# EAGLE schematic Tyr (EAGLE 9.5.2)

## Sheet 1 of 3
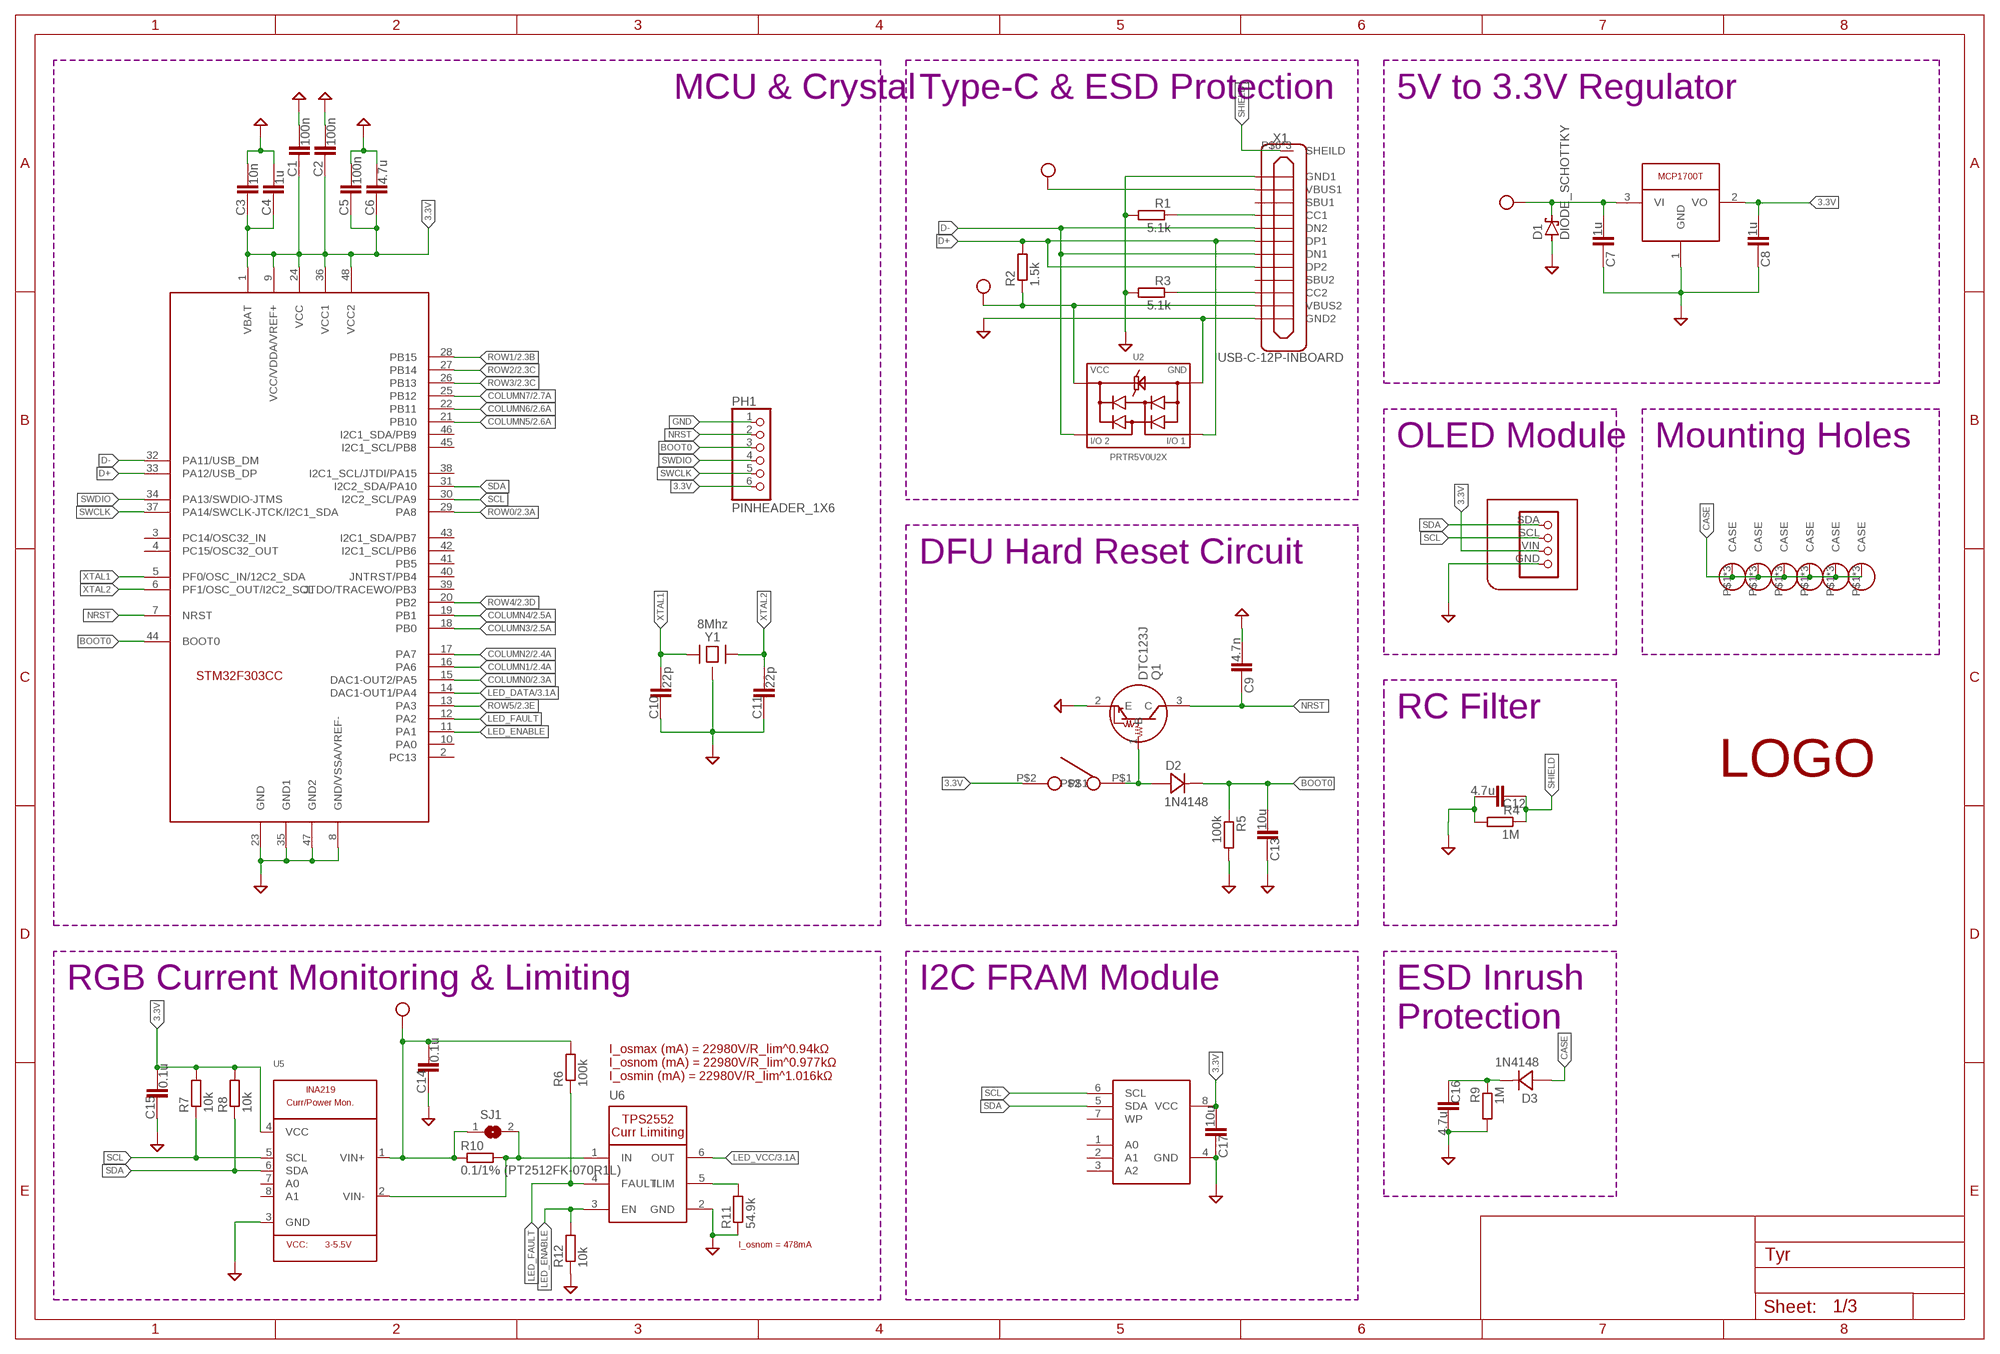
[diagram p0: schematic, sheet 1]

### Parts
C1  100n  CAPACITOR-0603  [C0603]
C2  100n  CAPACITOR-0603  [C0603]
C3  10n  CAPACITOR-0603  [C0603]
C4  1u  CAPACITOR-0603  [C0603]
C5  100n  CAPACITOR-0603  [C0603]
C6  4.7u  CAPACITOR-0603  [C0603]
C7  1u  CAPACITOR-0603  [C0603]
C8  1u  CAPACITOR-0603  [C0603]
C9  4.7n  CAPACITOR-0603  [C0603]
C10  22p  CAPACITOR-0603  [C0603]
C11  22p  CAPACITOR-0603  [C0603]
C12  4.7u  CAPACITOR-0603  [C0603]
C13  10u  CAPACITOR-0603  [C0603]
C14  0.1u  CAPACITOR-0603  [C0603]
C15  0.1u  CAPACITOR-0603  [C0603]
C16  4.7u  CAPACITOR-0603  [C0603]
C17  10u  CAPACITOR-0603  [C0603]
D1  DIODE_SCHOTTKY  [SOD-123]
D2  1N4148  DIODE-SOD-123  [SOD-123]
D3  1N4148  DIODE-SOD-123  [SOD-123]
HOLE1  MOUNT_HOLE-5MM_NOTCH  [HOLE_5MM_OVAL]
HOLE2  MOUNT_HOLE-5MM_NOTCH  [HOLE_5MM_OVAL]
HOLE3  MOUNT_HOLE  [HOLE_M3_OVAL]
HOLE4  MOUNT_HOLE  [HOLE_M3_OVAL]
HOLE5  MOUNT_HOLE  [HOLE_M3_OVAL]
HOLE6  MOUNT_HOLE  [HOLE_M3_OVAL]
J1  TYR_DISPLAY  [TYR_TYR_DISPLAY]
LOGO1  LOGO_TYR  [LOGO_TYR_COPPER]
PH1  PINHEADER_1X6  [1X06]
Q1  DTC123J  [SOT-323]
R1  5.1k  RESISTOR-0603  [R0603]
R2  1.5k  RESISTOR-0603  [R0603]
R3  5.1k  RESISTOR-0603  [R0603]
R4  1M  RESISTOR-0603  [R0603]
R5  100k  RESISTOR-0603  [R0603]
R6  100k  RESISTOR-0603  [R0603]
R7  10k  RESISTOR-0603  [R0603]
R8  10k  RESISTOR-0603  [R0603]
R9  1M  RESISTOR-0603  [R0603]
R10  0.1/1% (PT2512FK-070R1L)  RESISTOR-2512  [R2512]
R11  54.9k  RESISTOR-0603  [R0603]
R12  10k  RESISTOR-0603  [R0603]
SJ1  SOLDERJUMPER  [SOLDERJUMPER_ARROW_NOPASTE]
SW1  BUTTON  [BUTTON_3*6*2.5]
U1  MCP1700T  [SOT-23]
U2  PRTR5V0U2X  [PRTR5V0U2X]
U3  STM32F303CC  [LQFP48]
U4  MB85RC256V  [SOP-8]
U5  INA219  [SOT23-8]
U6  TPS2552  [SOT-23-6P]
X1  USB-C-12P-INBOARD  CONTROLLER_USB-C-12PUSB-C-12P-INBOARD  [USB-C-12P-INBOARD]
Y1  8Mhz  CRYSTAL-4PIN-3.2X2.5  [CRYSTAL-3.2X2.5]

### Nets
3.3V: C1.1 C2.1 C3.1 C4.1 C5.1 C6.1 C8.2 C15.2 C17.2 J1.VIN PH1.6 R7.2 R8.2 SW1.P$2 U1.2(VO) U3.1(VBAT) U3.9(VCC/VDDA/VREF+) U3.24(VCC) U3.36(VCC1) U3.48(VCC2) U4.8(VCC) U5.4(VCC)
BOOT0: C13.2 D2.C PH1.3 R5.1 U3.44(BOOT0)
CASE: D3.A HOLE1.P$1(CASE) HOLE1.P$2(CASE) HOLE1.P$3(CASE) HOLE2.P$1(CASE) HOLE2.P$2(CASE) HOLE2.P$3(CASE) HOLE3.P$1(CASE) HOLE3.P$2(CASE) HOLE3.P$3(CASE) HOLE4.P$1(CASE) HOLE4.P$2(CASE) HOLE4.P$3(CASE) HOLE5.P$1(CASE) HOLE5.P$2(CASE) HOLE5.P$3(CASE) HOLE6.P$1(CASE) HOLE6.P$2(CASE) HOLE6.P$3(CASE)
COLUMN0: U3.15(DAC1-OUT2/PA5) ; also sheet 2
COLUMN1: U3.16(PA6) ; also sheet 2
COLUMN2: U3.17(PA7) ; also sheet 2
COLUMN3: U3.18(PB0) ; also sheet 2
COLUMN4: U3.19(PB1) ; also sheet 2
COLUMN5: U3.21(PB10) ; also sheet 2
COLUMN6: U3.22(PB11) ; also sheet 2
COLUMN7: U3.25(PB12) ; also sheet 2
D+: R2.2 U2.2 U3.33(PA12/USB_DP) X1.DP1 X1.DP2
D-: U2.3 U3.32(PA11/USB_DM) X1.DN1 X1.DN2
GND: C1.2 C2.2 C3.2 C4.2 C5.2 C6.2 C7.1 C8.1 C9.2 C10.1 C11.1 C12.2 C13.1 C14.1 C15.1 C16.2 C17.1 D1.A J1.GND PH1.1 Q1.2(E) R1.2 R3.2 R4.2 R5.2 R9.2 R11.1 R12.1 U1.1(GND) U2.1 U3.8(GND/VSSA/VREF-) U3.23(GND) U3.35(GND1) U3.47(GND2) U4.4(GND) U5.3(GND) U6.2(GND) X1.GND1 X1.GND2 Y1.2(GND) Y1.4(GND) ; also sheet 2,3
LED_DATA: U3.14(DAC1-OUT1/PA4) ; also sheet 3
LED_ENABLE: R12.2 U3.11(PA1) U6.3(EN)
LED_FAULT: R6.1 U3.12(PA2) U6.4(FAULT)
LED_VCC: U6.6(OUT) ; also sheet 3
N$2: R10.2 SJ1.2 U5.2(VIN-) U6.1(IN)
N$3: R11.2 U6.5(ILIM)
N$4: R1.1 X1.CC1
N$5: D2.A Q1.1(B) SW1.P$1
N$6: C16.1 D3.C R9.1
N$89: R3.1 X1.CC2
NRST: C9.1 PH1.2 Q1.3(C) U3.7(NRST)
ROW0: U3.29(PA8) ; also sheet 2
ROW1: U3.28(PB15) ; also sheet 2
ROW2: U3.27(PB14) ; also sheet 2
ROW3: U3.26(PB13) ; also sheet 2
ROW4: U3.20(PB2) ; also sheet 2
ROW5: U3.13(PA3) ; also sheet 2
SCL: J1.SCL R7.1 U3.30(I2C2_SCL/PA9) U4.6(SCL) U5.5(SCL)
SDA: J1.SDA R8.1 U3.31(I2C2_SDA/PA10) U4.5(SDA) U5.6(SDA)
SHIELD: C12.1 R4.1 X1.P$6(SHEILD) X1.P$9(SHEILD) X1.P$12(SHEILD)
SWCLK: PH1.5 U3.37(PA14/SWCLK-JTCK/I2C1_SDA)
SWDIO: PH1.4 U3.34(PA13/SWDIO-JTMS)
VCC: C7.2 C14.2 D1.C R2.1 R6.2 R10.1 SJ1.1 U1.3(VI) U2.4 U5.1(VIN+) X1.VBUS1 X1.VBUS2
XTAL1: C10.2 U3.5(PF0/OSC_IN/12C2_SDA) Y1.1
XTAL2: C11.2 U3.6(PF1/OSC_OUT/I2C2_SCL) Y1.3
Unconnected: U3.2(PC13) U3.3(PC14/OSC32_IN) U3.4(PC15/OSC32_OUT) U3.10(PA0) U3.38(I2C1_SCL/JTDI/PA15) U3.39(JTDO/TRACEWO/PB3) U3.40(JNTRST/PB4) U3.41(PB5) U3.42(I2C1_SCL/PB6) U3.43(I2C1_SDA/PB7) U3.45(I2C1_SCL/PB8) U3.46(I2C1_SDA/PB9) U4.1(A0) U4.2(A1) U4.3(A2) U4.7(WP) U5.7(A0) U5.8(A1) X1.SBU1 X1.SBU2

### Notes on the sheet
- MCU & Crystal | Type-C & ESD Protection | 5V to 3.3V Regulator
- OLED Module | Mounting Holes
- DFU Hard Reset Circuit
- RC Filter
- RGB Current Monitoring & Limiting | I2C FRAM Module
- ESD Inrush
  Protection
- I_osmax (mA) = 22980V/R_lim^0.94kΩ
  I_osnom (mA) = 22980V/R_lim^0.977kΩ
  I_osmin (mA) = 22980V/R_lim^1.016kΩ
- I_osnom = 478mA

## Sheet 2 of 3: Keysiwtch Matrix
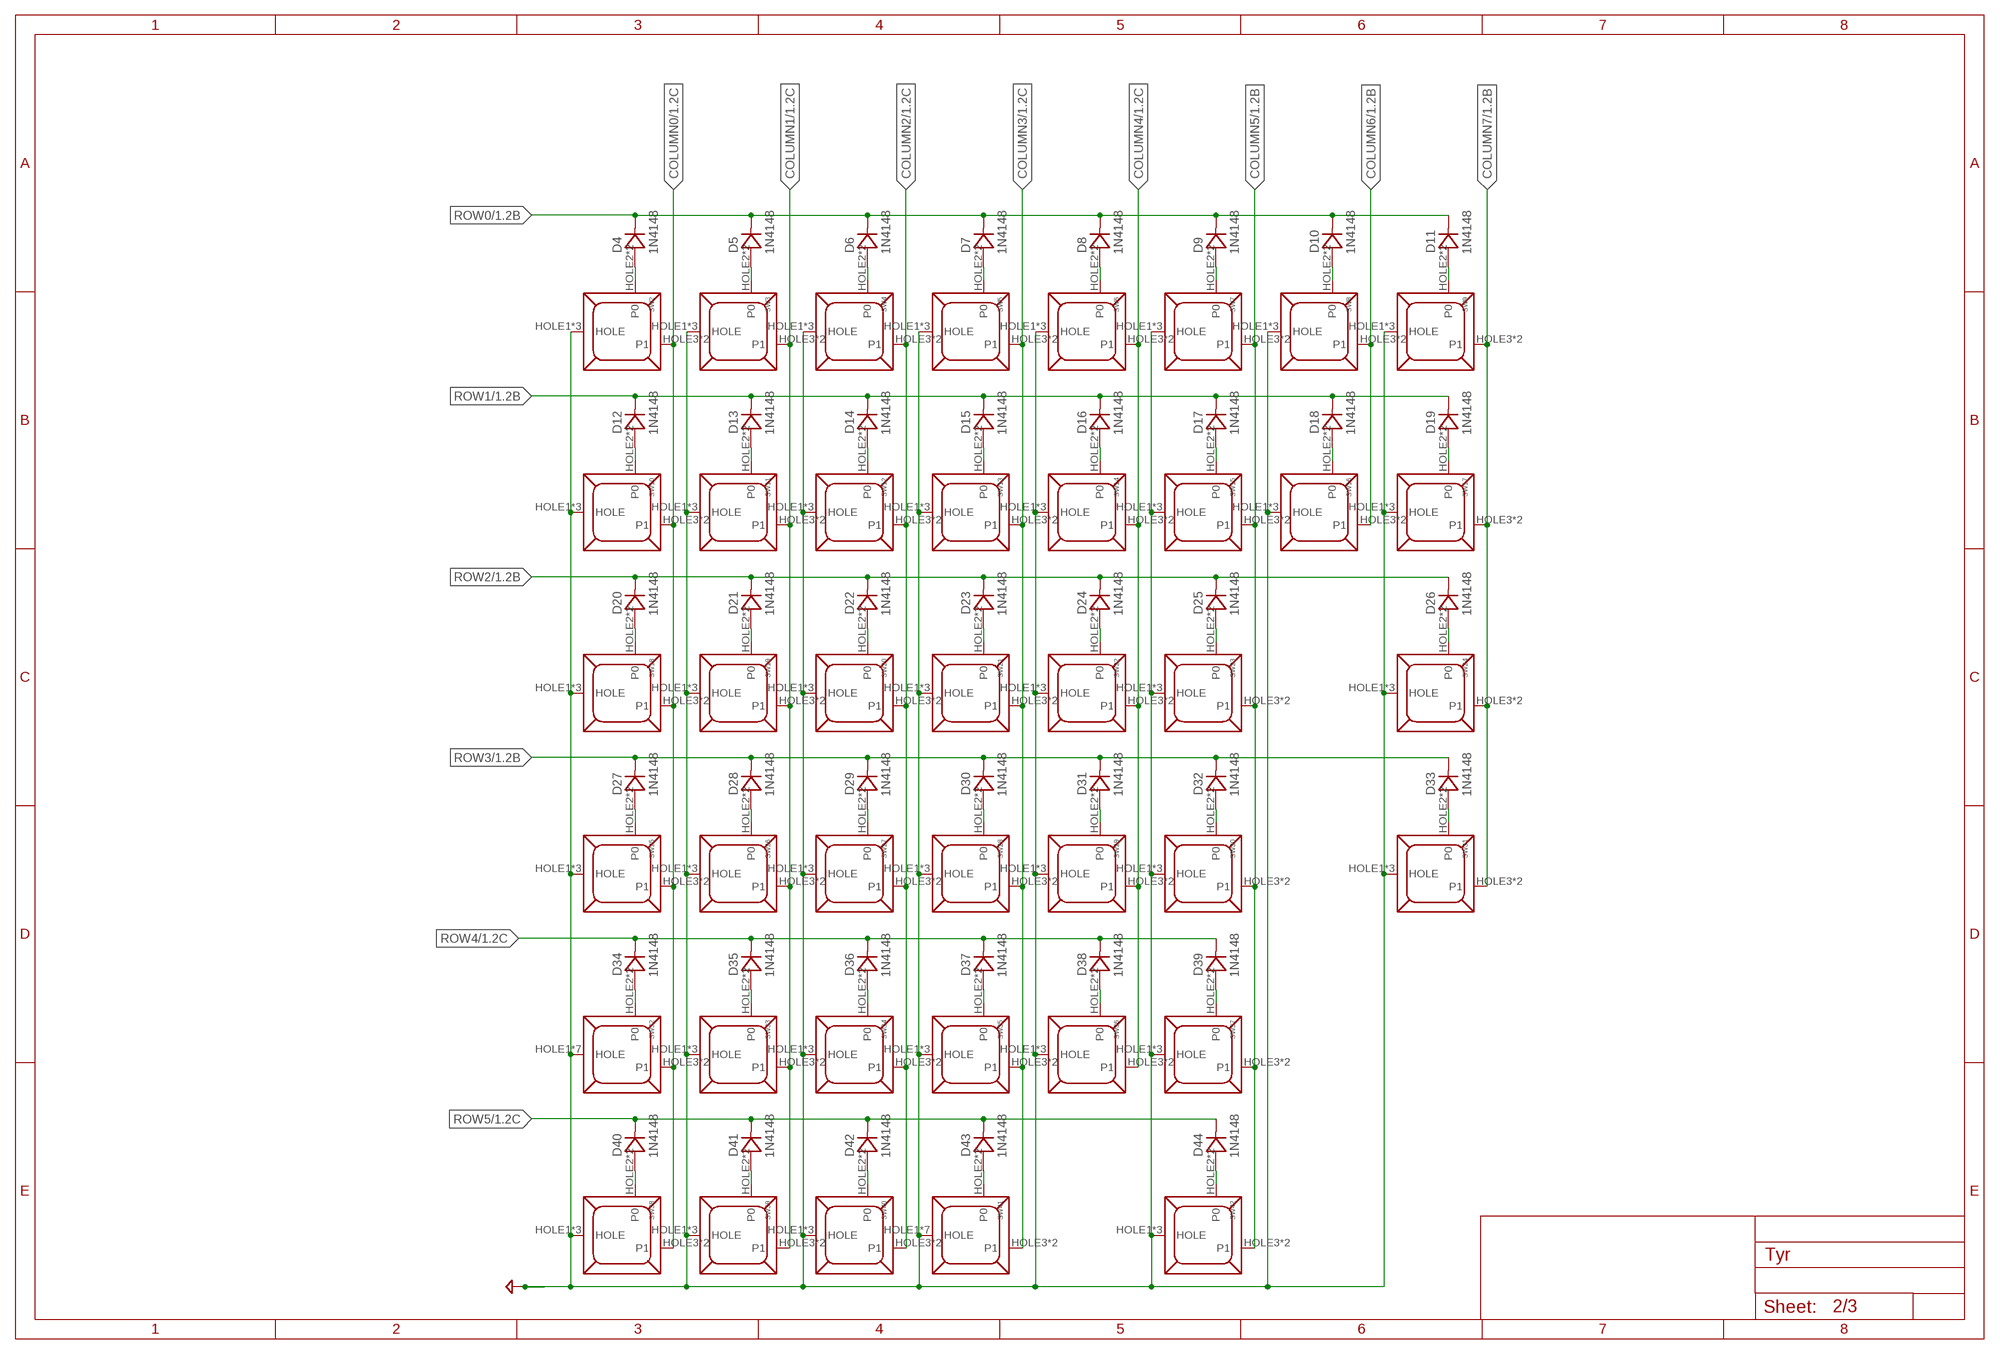
[diagram p1: schematic, sheet 2]

### Parts
D4  1N4148  DIODE-SOD-123  [SOD-123]
D5  1N4148  DIODE-SOD-123  [SOD-123]
D6  1N4148  DIODE-SOD-123  [SOD-123]
D7  1N4148  DIODE-SOD-123  [SOD-123]
D8  1N4148  DIODE-SOD-123  [SOD-123]
D9  1N4148  DIODE-SOD-123  [SOD-123]
D10  1N4148  DIODE-SOD-123  [SOD-123]
D11  1N4148  DIODE-SOD-123  [SOD-123]
D12  1N4148  DIODE-SOD-123  [SOD-123]
D13  1N4148  DIODE-SOD-123  [SOD-123]
D14  1N4148  DIODE-SOD-123  [SOD-123]
D15  1N4148  DIODE-SOD-123  [SOD-123]
D16  1N4148  DIODE-SOD-123  [SOD-123]
D17  1N4148  DIODE-SOD-123  [SOD-123]
D18  1N4148  DIODE-SOD-123  [SOD-123]
D19  1N4148  DIODE-SOD-123  [SOD-123]
D20  1N4148  DIODE-SOD-123  [SOD-123]
D21  1N4148  DIODE-SOD-123  [SOD-123]
D22  1N4148  DIODE-SOD-123  [SOD-123]
D23  1N4148  DIODE-SOD-123  [SOD-123]
D24  1N4148  DIODE-SOD-123  [SOD-123]
D25  1N4148  DIODE-SOD-123  [SOD-123]
D26  1N4148  DIODE-SOD-123  [SOD-123]
D27  1N4148  DIODE-SOD-123  [SOD-123]
D28  1N4148  DIODE-SOD-123  [SOD-123]
D29  1N4148  DIODE-SOD-123  [SOD-123]
D30  1N4148  DIODE-SOD-123  [SOD-123]
D31  1N4148  DIODE-SOD-123  [SOD-123]
D32  1N4148  DIODE-SOD-123  [SOD-123]
D33  1N4148  DIODE-SOD-123  [SOD-123]
D34  1N4148  DIODE-SOD-123  [SOD-123]
D35  1N4148  DIODE-SOD-123  [SOD-123]
D36  1N4148  DIODE-SOD-123  [SOD-123]
D37  1N4148  DIODE-SOD-123  [SOD-123]
D38  1N4148  DIODE-SOD-123  [SOD-123]
D39  1N4148  DIODE-SOD-123  [SOD-123]
D40  1N4148  DIODE-SOD-123  [SOD-123]
D41  1N4148  DIODE-SOD-123  [SOD-123]
D42  1N4148  DIODE-SOD-123  [SOD-123]
D43  1N4148  DIODE-SOD-123  [SOD-123]
D44  1N4148  DIODE-SOD-123  [SOD-123]
SW2  MX  KEYSWITCH-MX_PLATED-1U-HOTSWAP  [MX-1U-HOTSWAP]
SW3  MX  KEYSWITCH-MX_PLATED-1U-HOTSWAP  [MX-1U-HOTSWAP]
SW4  MX  KEYSWITCH-MX_PLATED-1U-HOTSWAP  [MX-1U-HOTSWAP]
SW5  MX  KEYSWITCH-MX_PLATED-1U-HOTSWAP  [MX-1U-HOTSWAP]
SW6  MX  KEYSWITCH-MX_PLATED-1U-HOTSWAP  [MX-1U-HOTSWAP]
SW7  MX  KEYSWITCH-MX_PLATED-1U-HOTSWAP  [MX-1U-HOTSWAP]
SW8  MX  KEYSWITCH-MX_PLATED-1U-HOTSWAP  [MX-1U-HOTSWAP]
SW9  MX  KEYSWITCH-MX_PLATED-1U-HOTSWAP  [MX-1U-HOTSWAP]
SW10  MX  KEYSWITCH-MX_PLATED-1U-HOTSWAP  [MX-1U-HOTSWAP]
SW11  MX  KEYSWITCH-MX_PLATED-1U-HOTSWAP  [MX-1U-HOTSWAP]
SW12  MX  KEYSWITCH-MX_PLATED-1U-HOTSWAP  [MX-1U-HOTSWAP]
SW13  MX  KEYSWITCH-MX_PLATED-1U-HOTSWAP  [MX-1U-HOTSWAP]
SW14  MX  KEYSWITCH-MX_PLATED-1U-HOTSWAP  [MX-1U-HOTSWAP]
SW15  MX  KEYSWITCH-MX_PLATED-1U-HOTSWAP  [MX-1U-HOTSWAP]
SW16  MX  KEYSWITCH-MX_PLATED-1U-HOTSWAP  [MX-1U-HOTSWAP]
SW17  MX  KEYSWITCH-MX_PLATED-1U-HOTSWAP  [MX-1U-HOTSWAP]
SW18  MX  KEYSWITCH-MX_PLATED-1U-HOTSWAP  [MX-1U-HOTSWAP]
SW19  MX  KEYSWITCH-MX_PLATED-1U-HOTSWAP  [MX-1U-HOTSWAP]
SW20  MX  KEYSWITCH-MX_PLATED-1U-HOTSWAP  [MX-1U-HOTSWAP]
SW21  MX  KEYSWITCH-MX_PLATED-1U-HOTSWAP  [MX-1U-HOTSWAP]
SW22  MX  KEYSWITCH-MX_PLATED-1U-HOTSWAP  [MX-1U-HOTSWAP]
SW23  MX  KEYSWITCH-MX_PLATED-1U-HOTSWAP  [MX-1U-HOTSWAP]
SW24  MX  KEYSWITCH-MX_PLATED-1U-HOTSWAP  [MX-1U-HOTSWAP]
SW25  MX  KEYSWITCH-MX_PLATED-1U-HOTSWAP_CAPSLOCK  [MX-1U-HOTSWAP-CAPSLOCK]
SW26  MX  KEYSWITCH-MX_PLATED-1U-HOTSWAP  [MX-1U-HOTSWAP]
SW27  MX  KEYSWITCH-MX_PLATED-1U-HOTSWAP  [MX-1U-HOTSWAP]
SW28  MX  KEYSWITCH-MX_PLATED-1U-HOTSWAP  [MX-1U-HOTSWAP]
SW29  MX  KEYSWITCH-MX_PLATED-1U-HOTSWAP  [MX-1U-HOTSWAP]
SW30  MX  KEYSWITCH-MX_PLATED-1U-HOTSWAP  [MX-1U-HOTSWAP]
SW31  MX  KEYSWITCH-MX_PLATED-1U-HOTSWAP  [MX-1U-HOTSWAP]
SW32  MX  KEYSWITCH-MX_PLATED-2U-HOTSWAP  [MX-2U-HOTSWAP]
SW33  MX  KEYSWITCH-MX_PLATED-1U-HOTSWAP  [MX-1U-HOTSWAP]
SW34  MX  KEYSWITCH-MX_PLATED-1U-HOTSWAP  [MX-1U-HOTSWAP]
SW35  MX  KEYSWITCH-MX_PLATED-1U-HOTSWAP  [MX-1U-HOTSWAP]
SW36  MX  KEYSWITCH-MX_PLATED-1U-HOTSWAP  [MX-1U-HOTSWAP]
SW37  MX  KEYSWITCH-MX_PLATED-1U-HOTSWAP  [MX-1U-HOTSWAP]
SW38  MX  KEYSWITCH-MX_PLATED-1U-HOTSWAP  [MX-1U-HOTSWAP]
SW39  MX  KEYSWITCH-MX_PLATED-1U-HOTSWAP  [MX-1U-HOTSWAP]
SW40  MX  KEYSWITCH-MX_PLATED-1U-HOTSWAP  [MX-1U-HOTSWAP]
SW41  MX  KEYSWITCH-MX_PLATED-2U-HOTSWAP  [MX-2U-HOTSWAP]
SW42  MX  KEYSWITCH-MX_PLATED-1U-HOTSWAP  [MX-1U-HOTSWAP]

### Nets
COLUMN0: SW2.HOLE3(P1) SW2.P$1(P1) SW10.HOLE3(P1) SW10.P$1(P1) SW18.HOLE3(P1) SW18.P$1(P1) SW25.HOLE3(P1) SW25.P$1(P1) SW32.HOLE3(P1) SW32.P$1(P1) SW38.HOLE3(P1) SW38.P$1(P1) ; also sheet 1
COLUMN1: SW3.HOLE3(P1) SW3.P$1(P1) SW11.HOLE3(P1) SW11.P$1(P1) SW19.HOLE3(P1) SW19.P$1(P1) SW26.HOLE3(P1) SW26.P$1(P1) SW33.HOLE3(P1) SW33.P$1(P1) SW39.HOLE3(P1) SW39.P$1(P1) ; also sheet 1
COLUMN2: SW4.HOLE3(P1) SW4.P$1(P1) SW12.HOLE3(P1) SW12.P$1(P1) SW20.HOLE3(P1) SW20.P$1(P1) SW27.HOLE3(P1) SW27.P$1(P1) SW34.HOLE3(P1) SW34.P$1(P1) SW40.HOLE3(P1) SW40.P$1(P1) ; also sheet 1
COLUMN3: SW5.HOLE3(P1) SW5.P$1(P1) SW13.HOLE3(P1) SW13.P$1(P1) SW21.HOLE3(P1) SW21.P$1(P1) SW28.HOLE3(P1) SW28.P$1(P1) SW35.HOLE3(P1) SW35.P$1(P1) SW41.HOLE3(P1) SW41.P$1(P1) ; also sheet 1
COLUMN4: SW6.HOLE3(P1) SW6.P$1(P1) SW14.HOLE3(P1) SW14.P$1(P1) SW22.HOLE3(P1) SW22.P$1(P1) SW29.HOLE3(P1) SW29.P$1(P1) SW36.HOLE3(P1) SW36.P$1(P1) ; also sheet 1
COLUMN5: SW7.HOLE3(P1) SW7.P$1(P1) SW15.HOLE3(P1) SW15.P$1(P1) SW23.HOLE3(P1) SW23.P$1(P1) SW30.HOLE3(P1) SW30.P$1(P1) SW37.HOLE3(P1) SW37.P$1(P1) SW42.HOLE3(P1) SW42.P$1(P1) ; also sheet 1
COLUMN6: SW8.HOLE3(P1) SW8.P$1(P1) SW16.HOLE3(P1) SW16.P$1(P1) ; also sheet 1
COLUMN7: SW9.HOLE3(P1) SW9.P$1(P1) SW17.HOLE3(P1) SW17.P$1(P1) SW24.HOLE3(P1) SW24.P$1(P1) SW31.HOLE3(P1) SW31.P$1(P1) ; also sheet 1
GND: SW2.HOLE1(HOLE) SW2.HOLE4(HOLE) SW2.HOLE5(HOLE) SW3.HOLE1(HOLE) SW3.HOLE4(HOLE) SW3.HOLE5(HOLE) SW4.HOLE1(HOLE) SW4.HOLE4(HOLE) SW4.HOLE5(HOLE) SW5.HOLE1(HOLE) SW5.HOLE4(HOLE) SW5.HOLE5(HOLE) SW6.HOLE1(HOLE) SW6.HOLE4(HOLE) SW6.HOLE5(HOLE) SW7.HOLE1(HOLE) SW7.HOLE4(HOLE) SW7.HOLE5(HOLE) SW8.HOLE1(HOLE) SW8.HOLE4(HOLE) SW8.HOLE5(HOLE) SW9.HOLE1(HOLE) SW9.HOLE4(HOLE) SW9.HOLE5(HOLE) SW10.HOLE1(HOLE) SW10.HOLE4(HOLE) SW10.HOLE5(HOLE) SW11.HOLE1(HOLE) SW11.HOLE4(HOLE) SW11.HOLE5(HOLE) SW12.HOLE1(HOLE) SW12.HOLE4(HOLE) SW12.HOLE5(HOLE) SW13.HOLE1(HOLE) SW13.HOLE4(HOLE) SW13.HOLE5(HOLE) SW14.HOLE1(HOLE) SW14.HOLE4(HOLE) SW14.HOLE5(HOLE) SW15.HOLE1(HOLE) SW15.HOLE4(HOLE) SW15.HOLE5(HOLE) SW16.HOLE1(HOLE) SW16.HOLE4(HOLE) SW16.HOLE5(HOLE) SW17.HOLE1(HOLE) SW17.HOLE4(HOLE) SW17.HOLE5(HOLE) SW18.HOLE1(HOLE) SW18.HOLE4(HOLE) SW18.HOLE5(HOLE) SW19.HOLE1(HOLE) SW19.HOLE4(HOLE) SW19.HOLE5(HOLE) SW20.HOLE1(HOLE) SW20.HOLE4(HOLE) SW20.HOLE5(HOLE) SW21.HOLE1(HOLE) SW21.HOLE4(HOLE) SW21.HOLE5(HOLE) SW22.HOLE1(HOLE) SW22.HOLE4(HOLE) SW22.HOLE5(HOLE) SW23.HOLE1(HOLE) SW23.HOLE4(HOLE) SW23.HOLE5(HOLE) SW24.HOLE1(HOLE) SW24.HOLE4(HOLE) SW24.HOLE5(HOLE) SW25.HOLE1(HOLE) SW25.HOLE4(HOLE) SW25.HOLE5(HOLE) SW26.HOLE1(HOLE) SW26.HOLE4(HOLE) SW26.HOLE5(HOLE) SW27.HOLE1(HOLE) SW27.HOLE4(HOLE) SW27.HOLE5(HOLE) SW28.HOLE1(HOLE) SW28.HOLE4(HOLE) SW28.HOLE5(HOLE) SW29.HOLE1(HOLE) SW29.HOLE4(HOLE) SW29.HOLE5(HOLE) SW30.HOLE1(HOLE) SW30.HOLE4(HOLE) SW30.HOLE5(HOLE) SW31.HOLE1(HOLE) SW31.HOLE4(HOLE) SW31.HOLE5(HOLE) SW32.HOLE1(HOLE) SW32.HOLE4(HOLE) SW32.HOLE5(HOLE) SW32.HOLE6(HOLE) SW32.HOLE7(HOLE) SW32.HOLE8(HOLE) SW32.HOLE9(HOLE) SW33.HOLE1(HOLE) SW33.HOLE4(HOLE) SW33.HOLE5(HOLE) SW34.HOLE1(HOLE) SW34.HOLE4(HOLE) SW34.HOLE5(HOLE) SW35.HOLE1(HOLE) SW35.HOLE4(HOLE) SW35.HOLE5(HOLE) SW36.HOLE1(HOLE) SW36.HOLE4(HOLE) SW36.HOLE5(HOLE) SW37.HOLE1(HOLE) SW37.HOLE4(HOLE) SW37.HOLE5(HOLE) SW38.HOLE1(HOLE) SW38.HOLE4(HOLE) SW38.HOLE5(HOLE) SW39.HOLE1(HOLE) SW39.HOLE4(HOLE) SW39.HOLE5(HOLE) SW40.HOLE1(HOLE) SW40.HOLE4(HOLE) SW40.HOLE5(HOLE) SW41.HOLE1(HOLE) SW41.HOLE4(HOLE) SW41.HOLE5(HOLE) SW41.HOLE6(HOLE) SW41.HOLE7(HOLE) SW41.HOLE8(HOLE) SW41.HOLE9(HOLE) SW42.HOLE1(HOLE) SW42.HOLE4(HOLE) SW42.HOLE5(HOLE) ; also sheet 1,3
N$1: D13.A SW11.HOLE2(P0) SW11.P$2(P0)
N$10: D4.A SW2.HOLE2(P0) SW2.P$2(P0)
N$11: D5.A SW3.HOLE2(P0) SW3.P$2(P0)
N$12: D6.A SW4.HOLE2(P0) SW4.P$2(P0)
N$13: D7.A SW5.HOLE2(P0) SW5.P$2(P0)
N$14: D8.A SW6.HOLE2(P0) SW6.P$2(P0)
N$15: D9.A SW7.HOLE2(P0) SW7.P$2(P0)
N$16: D10.A SW8.HOLE2(P0) SW8.P$2(P0)
N$17: D11.A SW9.HOLE2(P0) SW9.P$2(P0)
N$18: D19.A SW17.HOLE2(P0) SW17.P$2(P0)
N$19: D18.A SW16.HOLE2(P0) SW16.P$2(P0)
N$20: D17.A SW15.HOLE2(P0) SW15.P$2(P0)
N$21: D16.A SW14.HOLE2(P0) SW14.P$2(P0)
N$22: D15.A SW13.HOLE2(P0) SW13.P$2(P0)
N$23: D14.A SW12.HOLE2(P0) SW12.P$2(P0)
N$24: D12.A SW10.HOLE2(P0) SW10.P$2(P0)
N$25: D26.A SW24.HOLE2(P0) SW24.P$2(P0)
N$26: D25.A SW23.HOLE2(P0) SW23.P$2(P0)
N$27: D24.A SW22.HOLE2(P0) SW22.P$2(P0)
N$28: D23.A SW21.HOLE2(P0) SW21.P$2(P0)
N$29: D22.A SW20.HOLE2(P0) SW20.P$2(P0)
N$31: D20.A SW18.HOLE2(P0) SW18.P$2(P0)
N$32: D27.A SW25.HOLE2(P0) SW25.P$2(P0)
N$33: D28.A SW26.HOLE2(P0) SW26.P$2(P0)
N$34: D29.A SW27.HOLE2(P0) SW27.P$2(P0)
N$35: D30.A SW28.HOLE2(P0) SW28.P$2(P0)
N$36: D31.A SW29.HOLE2(P0) SW29.P$2(P0)
N$37: D32.A SW30.HOLE2(P0) SW30.P$2(P0)
N$38: D33.A SW31.HOLE2(P0) SW31.P$2(P0)
N$39: D39.A SW37.HOLE2(P0) SW37.P$2(P0)
N$40: D37.A SW35.HOLE2(P0) SW35.P$2(P0)
N$41: D36.A SW34.HOLE2(P0) SW34.P$2(P0)
N$42: D35.A SW33.HOLE2(P0) SW33.P$2(P0)
N$43: D34.A SW32.HOLE2(P0) SW32.P$2(P0)
N$44: D40.A SW38.HOLE2(P0) SW38.P$2(P0)
N$45: D41.A SW39.HOLE2(P0) SW39.P$2(P0)
N$46: D42.A SW40.HOLE2(P0) SW40.P$2(P0)
N$47: D43.A SW41.HOLE2(P0) SW41.P$2(P0)
N$48: D44.A SW42.HOLE2(P0) SW42.P$2(P0)
N$49: D38.A SW36.HOLE2(P0) SW36.P$2(P0)
N$50: D21.A SW19.HOLE2(P0) SW19.P$2(P0)
ROW0: D4.C D5.C D6.C D7.C D8.C D9.C D10.C D11.C ; also sheet 1
ROW1: D12.C D13.C D14.C D15.C D16.C D17.C D18.C D19.C ; also sheet 1
ROW2: D20.C D21.C D22.C D23.C D24.C D25.C D26.C ; also sheet 1
ROW3: D27.C D28.C D29.C D30.C D31.C D32.C D33.C ; also sheet 1
ROW4: D34.C D35.C D36.C D37.C D38.C D39.C ; also sheet 1
ROW5: D40.C D41.C D42.C D43.C D44.C ; also sheet 1

## Sheet 3 of 3: RGB Matrix
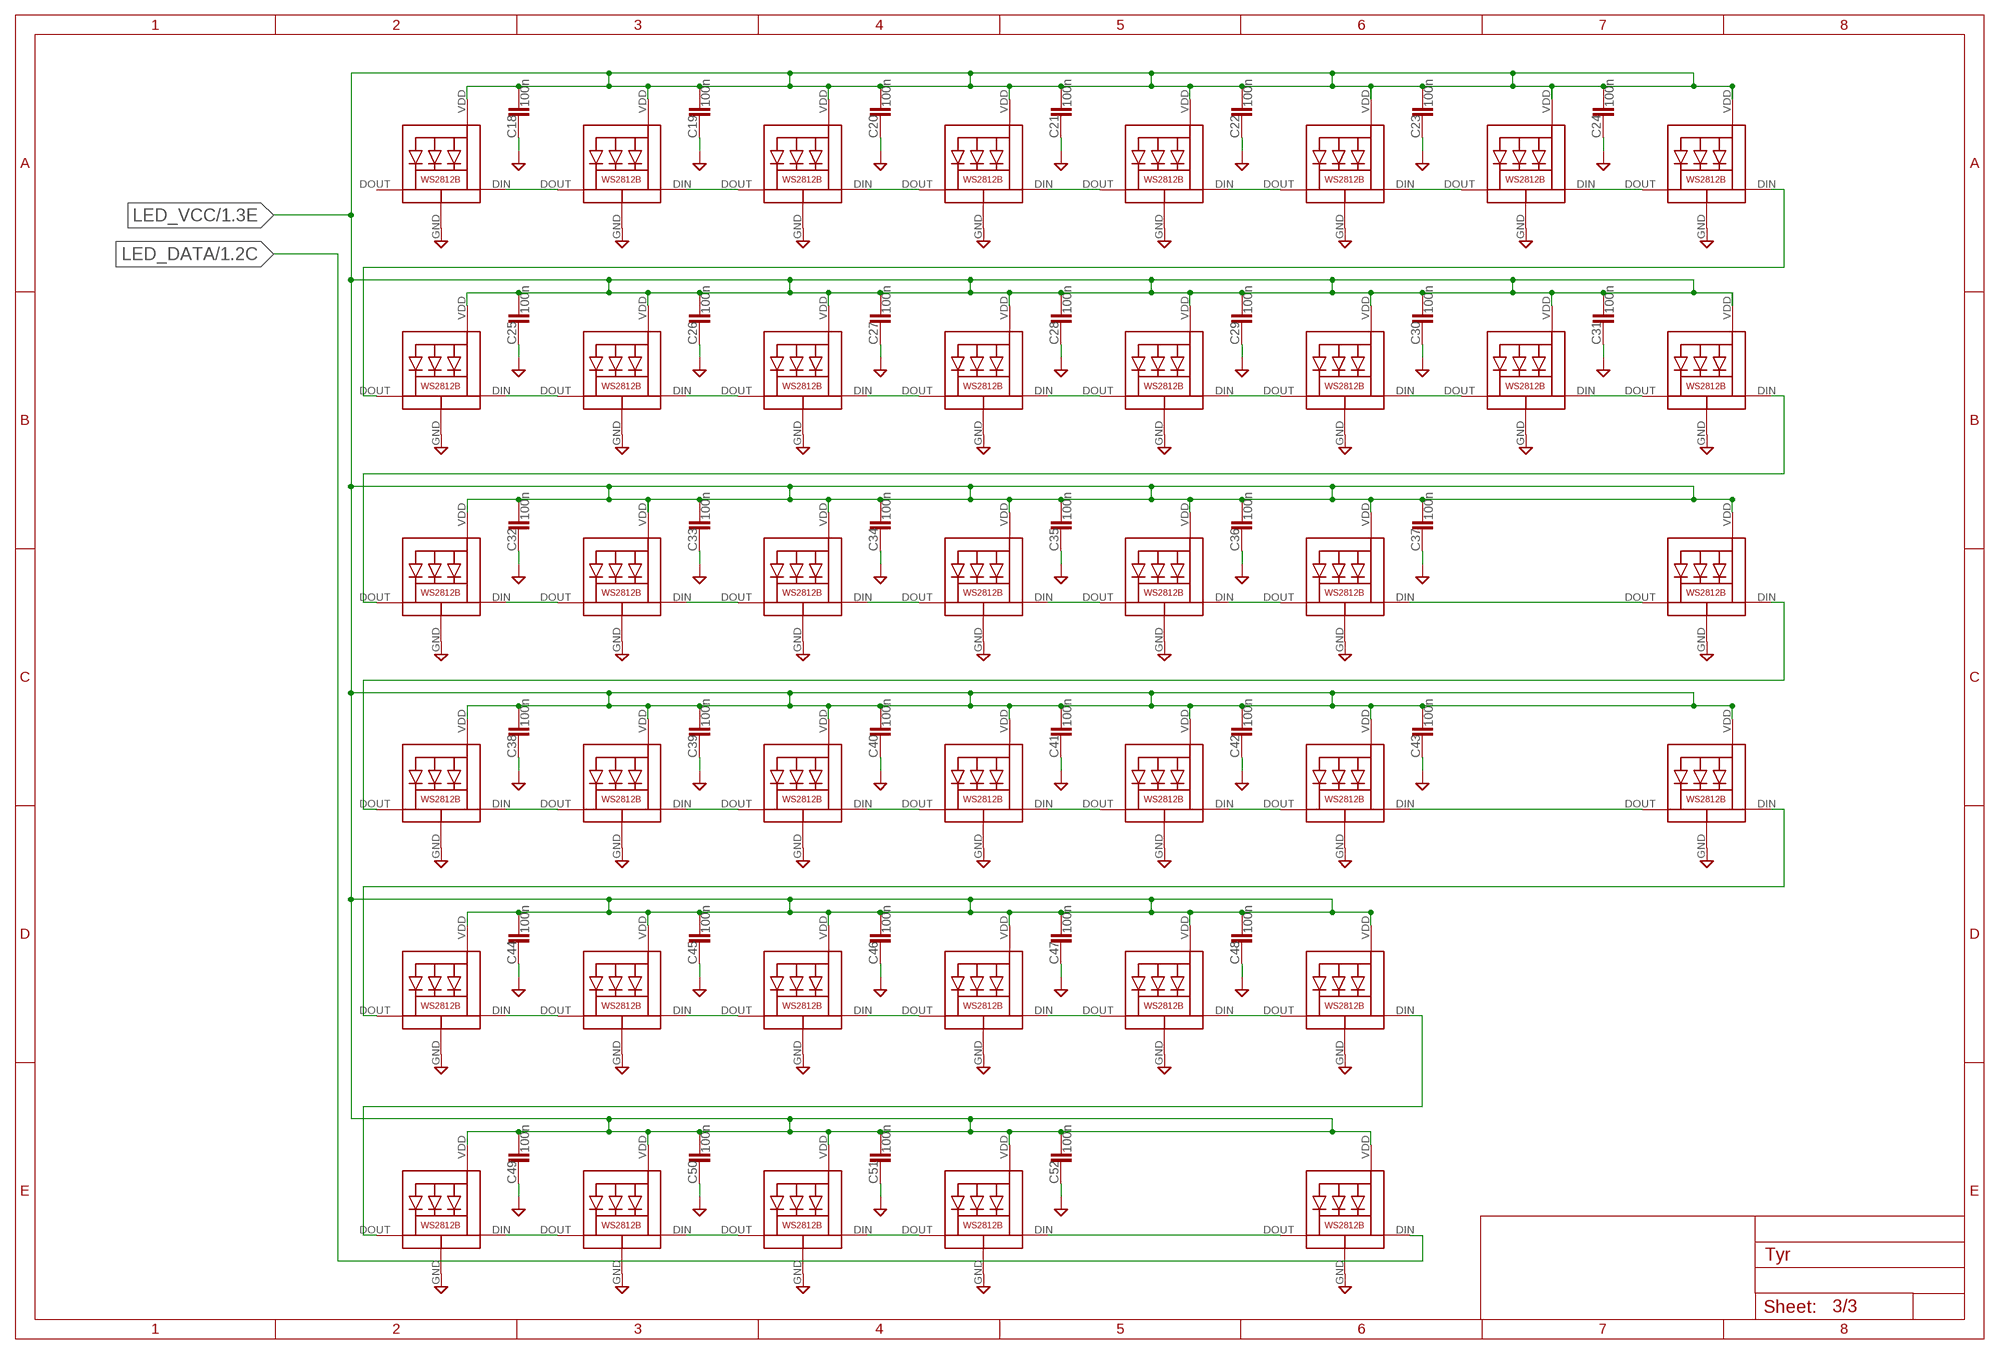
[diagram p2: schematic, sheet 3]

### Parts
C18  100n  CAPACITOR-0603  [C0603]
C19  100n  CAPACITOR-0603  [C0603]
C20  100n  CAPACITOR-0603  [C0603]
C21  100n  CAPACITOR-0603  [C0603]
C22  100n  CAPACITOR-0603  [C0603]
C23  100n  CAPACITOR-0603  [C0603]
C24  100n  CAPACITOR-0603  [C0603]
C25  100n  CAPACITOR-0603  [C0603]
C26  100n  CAPACITOR-0603  [C0603]
C27  100n  CAPACITOR-0603  [C0603]
C28  100n  CAPACITOR-0603  [C0603]
C29  100n  CAPACITOR-0603  [C0603]
C30  100n  CAPACITOR-0603  [C0603]
C31  100n  CAPACITOR-0603  [C0603]
C32  100n  CAPACITOR-0603  [C0603]
C33  100n  CAPACITOR-0603  [C0603]
C34  100n  CAPACITOR-0603  [C0603]
C35  100n  CAPACITOR-0603  [C0603]
C36  100n  CAPACITOR-0603  [C0603]
C37  100n  CAPACITOR-0603  [C0603]
C38  100n  CAPACITOR-0603  [C0603]
C39  100n  CAPACITOR-0603  [C0603]
C40  100n  CAPACITOR-0603  [C0603]
C41  100n  CAPACITOR-0603  [C0603]
C42  100n  CAPACITOR-0603  [C0603]
C43  100n  CAPACITOR-0603  [C0603]
C44  100n  CAPACITOR-0603  [C0603]
C45  100n  CAPACITOR-0603  [C0603]
C46  100n  CAPACITOR-0603  [C0603]
C47  100n  CAPACITOR-0603  [C0603]
C48  100n  CAPACITOR-0603  [C0603]
C49  100n  CAPACITOR-0603  [C0603]
C50  100n  CAPACITOR-0603  [C0603]
C51  100n  CAPACITOR-0603  [C0603]
C52  100n  CAPACITOR-0603  [C0603]
LED1  WS2812B_3528_REVERS-MOUNT  [WS2812B_3528_REVERS-MOUNT]
LED2  WS2812B_3528_REVERS-MOUNT  [WS2812B_3528_REVERS-MOUNT]
LED3  WS2812B_3528_REVERS-MOUNT  [WS2812B_3528_REVERS-MOUNT]
LED4  WS2812B_3528_REVERS-MOUNT  [WS2812B_3528_REVERS-MOUNT]
LED5  WS2812B_3528_REVERS-MOUNT  [WS2812B_3528_REVERS-MOUNT]
LED6  WS2812B_3528_REVERS-MOUNT  [WS2812B_3528_REVERS-MOUNT]
LED7  WS2812B_3528_REVERS-MOUNT  [WS2812B_3528_REVERS-MOUNT]
LED8  WS2812B_3528_REVERS-MOUNT  [WS2812B_3528_REVERS-MOUNT]
LED9  WS2812B_3528_REVERS-MOUNT  [WS2812B_3528_REVERS-MOUNT]
LED10  WS2812B_3528_REVERS-MOUNT  [WS2812B_3528_REVERS-MOUNT]
LED11  WS2812B_3528_REVERS-MOUNT  [WS2812B_3528_REVERS-MOUNT]
LED12  WS2812B_3528_REVERS-MOUNT  [WS2812B_3528_REVERS-MOUNT]
LED13  WS2812B_3528_REVERS-MOUNT  [WS2812B_3528_REVERS-MOUNT]
LED14  WS2812B_3528_REVERS-MOUNT  [WS2812B_3528_REVERS-MOUNT]
LED15  WS2812B_3528_REVERS-MOUNT  [WS2812B_3528_REVERS-MOUNT]
LED16  WS2812B_3528_REVERS-MOUNT  [WS2812B_3528_REVERS-MOUNT]
LED17  WS2812B_3528_REVERS-MOUNT  [WS2812B_3528_REVERS-MOUNT]
LED18  WS2812B_3528_REVERS-MOUNT  [WS2812B_3528_REVERS-MOUNT]
LED19  WS2812B_3528_REVERS-MOUNT  [WS2812B_3528_REVERS-MOUNT]
LED20  WS2812B_3528_REVERS-MOUNT  [WS2812B_3528_REVERS-MOUNT]
LED21  WS2812B_3528_REVERS-MOUNT  [WS2812B_3528_REVERS-MOUNT]
LED22  WS2812B_3528_REVERS-MOUNT  [WS2812B_3528_REVERS-MOUNT]
LED23  WS2812B_3528_REVERS-MOUNT  [WS2812B_3528_REVERS-MOUNT]
LED24  WS2812B_3528_REVERS-MOUNT  [WS2812B_3528_REVERS-MOUNT]
LED25  WS2812B_3528_REVERS-MOUNT  [WS2812B_3528_REVERS-MOUNT]
LED26  WS2812B_3528_REVERS-MOUNT  [WS2812B_3528_REVERS-MOUNT]
LED27  WS2812B_3528_REVERS-MOUNT  [WS2812B_3528_REVERS-MOUNT]
LED28  WS2812B_3528_REVERS-MOUNT  [WS2812B_3528_REVERS-MOUNT]
LED29  WS2812B_3528_REVERS-MOUNT  [WS2812B_3528_REVERS-MOUNT]
LED30  WS2812B_3528_REVERS-MOUNT  [WS2812B_3528_REVERS-MOUNT]
LED31  WS2812B_3528_REVERS-MOUNT  [WS2812B_3528_REVERS-MOUNT]
LED32  WS2812B_3528_REVERS-MOUNT  [WS2812B_3528_REVERS-MOUNT]
LED33  WS2812B_3528_REVERS-MOUNT  [WS2812B_3528_REVERS-MOUNT]
LED34  WS2812B_3528_REVERS-MOUNT  [WS2812B_3528_REVERS-MOUNT]
LED35  WS2812B_3528_REVERS-MOUNT  [WS2812B_3528_REVERS-MOUNT]
LED36  WS2812B_3528_REVERS-MOUNT  [WS2812B_3528_REVERS-MOUNT]
LED37  WS2812B_3528_REVERS-MOUNT  [WS2812B_3528_REVERS-MOUNT]
LED38  WS2812B_3528_REVERS-MOUNT  [WS2812B_3528_REVERS-MOUNT]
LED39  WS2812B_3528_REVERS-MOUNT  [WS2812B_3528_REVERS-MOUNT]
LED40  WS2812B_3528_REVERS-MOUNT  [WS2812B_3528_REVERS-MOUNT]
LED41  WS2812B_3528_REVERS-MOUNT  [WS2812B_3528_REVERS-MOUNT]

### Nets
GND: C18.1 C19.1 C20.1 C21.1 C22.1 C23.1 C24.1 C25.1 C26.1 C27.1 C28.1 C29.1 C30.1 C31.1 C32.1 C33.1 C34.1 C35.1 C36.1 C37.1 C38.1 C39.1 C40.1 C41.1 C42.1 C43.1 C44.1 C45.1 C46.1 C47.1 C48.1 C49.1 C50.1 C51.1 C52.1 LED1.GND LED2.GND LED3.GND LED4.GND LED5.GND LED6.GND LED7.GND LED8.GND LED9.GND LED10.GND LED11.GND LED12.GND LED13.GND LED14.GND LED15.GND LED16.GND LED17.GND LED18.GND LED19.GND LED20.GND LED21.GND LED22.GND LED23.GND LED24.GND LED25.GND LED26.GND LED27.GND LED28.GND LED29.GND LED30.GND LED31.GND LED32.GND LED33.GND LED34.GND LED35.GND LED36.GND LED37.GND LED38.GND LED39.GND LED40.GND LED41.GND ; also sheet 1,2
LED_DATA: LED41.DIN(DI) ; also sheet 1
LED_VCC: C18.2 C19.2 C20.2 C21.2 C22.2 C23.2 C24.2 C25.2 C26.2 C27.2 C28.2 C29.2 C30.2 C31.2 C32.2 C33.2 C34.2 C35.2 C36.2 C37.2 C38.2 C39.2 C40.2 C41.2 C42.2 C43.2 C44.2 C45.2 C46.2 C47.2 C48.2 C49.2 C50.2 C51.2 C52.2 LED1.VDD LED2.VDD LED3.VDD LED4.VDD LED5.VDD LED6.VDD LED7.VDD LED8.VDD LED9.VDD LED10.VDD LED11.VDD LED12.VDD LED13.VDD LED14.VDD LED15.VDD LED16.VDD LED17.VDD LED18.VDD LED19.VDD LED20.VDD LED21.VDD LED22.VDD LED23.VDD LED24.VDD LED25.VDD LED26.VDD LED27.VDD LED28.VDD LED29.VDD LED30.VDD LED31.VDD LED32.VDD LED33.VDD LED34.VDD LED35.VDD LED36.VDD LED37.VDD LED38.VDD LED39.VDD LED40.VDD LED41.VDD ; also sheet 1
N$9: LED40.DIN(DI) LED41.DOUT(DO)
N$30: LED39.DIN(DI) LED40.DOUT(DO)
N$51: LED38.DIN(DI) LED39.DOUT(DO)
N$52: LED37.DIN(DI) LED38.DOUT(DO)
N$53: LED36.DIN(DI) LED37.DOUT(DO)
N$54: LED35.DIN(DI) LED36.DOUT(DO)
N$55: LED34.DIN(DI) LED35.DOUT(DO)
N$56: LED33.DIN(DI) LED34.DOUT(DO)
N$57: LED32.DIN(DI) LED33.DOUT(DO)
N$58: LED31.DIN(DI) LED32.DOUT(DO)
N$59: LED30.DIN(DI) LED31.DOUT(DO)
N$60: LED29.DIN(DI) LED30.DOUT(DO)
N$61: LED28.DIN(DI) LED29.DOUT(DO)
N$62: LED27.DIN(DI) LED28.DOUT(DO)
N$63: LED26.DIN(DI) LED27.DOUT(DO)
N$64: LED25.DIN(DI) LED26.DOUT(DO)
N$65: LED24.DIN(DI) LED25.DOUT(DO)
N$66: LED23.DIN(DI) LED24.DOUT(DO)
N$67: LED22.DIN(DI) LED23.DOUT(DO)
N$68: LED21.DIN(DI) LED22.DOUT(DO)
N$69: LED20.DIN(DI) LED21.DOUT(DO)
N$70: LED19.DIN(DI) LED20.DOUT(DO)
N$71: LED18.DIN(DI) LED19.DOUT(DO)
N$72: LED17.DIN(DI) LED18.DOUT(DO)
N$73: LED16.DIN(DI) LED17.DOUT(DO)
N$74: LED15.DIN(DI) LED16.DOUT(DO)
N$75: LED14.DIN(DI) LED15.DOUT(DO)
N$76: LED13.DIN(DI) LED14.DOUT(DO)
N$77: LED12.DIN(DI) LED13.DOUT(DO)
N$78: LED11.DIN(DI) LED12.DOUT(DO)
N$79: LED10.DIN(DI) LED11.DOUT(DO)
N$80: LED9.DIN(DI) LED10.DOUT(DO)
N$81: LED8.DIN(DI) LED9.DOUT(DO)
N$82: LED7.DIN(DI) LED8.DOUT(DO)
N$83: LED6.DIN(DI) LED7.DOUT(DO)
N$84: LED5.DIN(DI) LED6.DOUT(DO)
N$85: LED4.DIN(DI) LED5.DOUT(DO)
N$86: LED3.DIN(DI) LED4.DOUT(DO)
N$87: LED2.DIN(DI) LED3.DOUT(DO)
N$88: LED1.DIN(DI) LED2.DOUT(DO)
Unconnected: LED1.DOUT(DO)

## Library data of the parts
C1-C52 = 1461748123:CAPACITOR
D1 = 1461748123:DIODE_SCHOTTKY: Schottky barrier diode Source: www.st.com, BAT60J.pdf
D2-D44 = 1461748123:DIODE: Standard 1N4148 diode
HOLE1-HOLE6 = 1461748123:MOUNT_HOLE
J1 = 1461748123:TYR_DISPLAY
LED1-LED41 = 1461748123:WS2812B_3528_REVERS-MOUNT
LOGO1 = 1461748123:LOGO_TYR
PH1 = 1461748123:PINHEADER_1X6
Q1 = 1461748123:DTC123J
R1-R12 = 1461748123:RESISTOR
SJ1 = 1461748123:SOLDERJUMPER: SMD Solder JUMPER Solder the two pads together to create a connection, or remove the solder to break it. REFLOW - Use this footprint for solder paste and reflow ovens. WAVE - Use this footprint for hand-soldering (larger pads). CLOSED - Has a trace between the two pads to ensure it is closed by default. The trace needs to be cut to disable the jumper, and can be closed again by creating a solder bridge between the two pads.; BOM: EXCLUDE
SW1 = 1461748123:BUTTON
SW2-SW42 = 1461748123:KEYSWITCH-MX_PLATED
U1 = 1461748123:MCP1700T
U2 = 1461748123:PRTR5V0U2X
U3 = 1461748123:STM32F303CC
U4 = 1461748123:MB85RC256V
U5 = 1461748123:INA219: INA219 - I2C Current/Power Monitor Voltage Range: 0-26V Accuracy: 0.5% Temperature: -40°C - 125°C
U6 = 1461748123:TPS2552
X1 = 1461748123:CONTROLLER_USB-C-12P
Y1 = 1461748123:CRYSTAL-4PIN